# Altium schematic sheet Sheet1.SchDoc
size A3; SheetNumber: 1; SheetTotal: 1
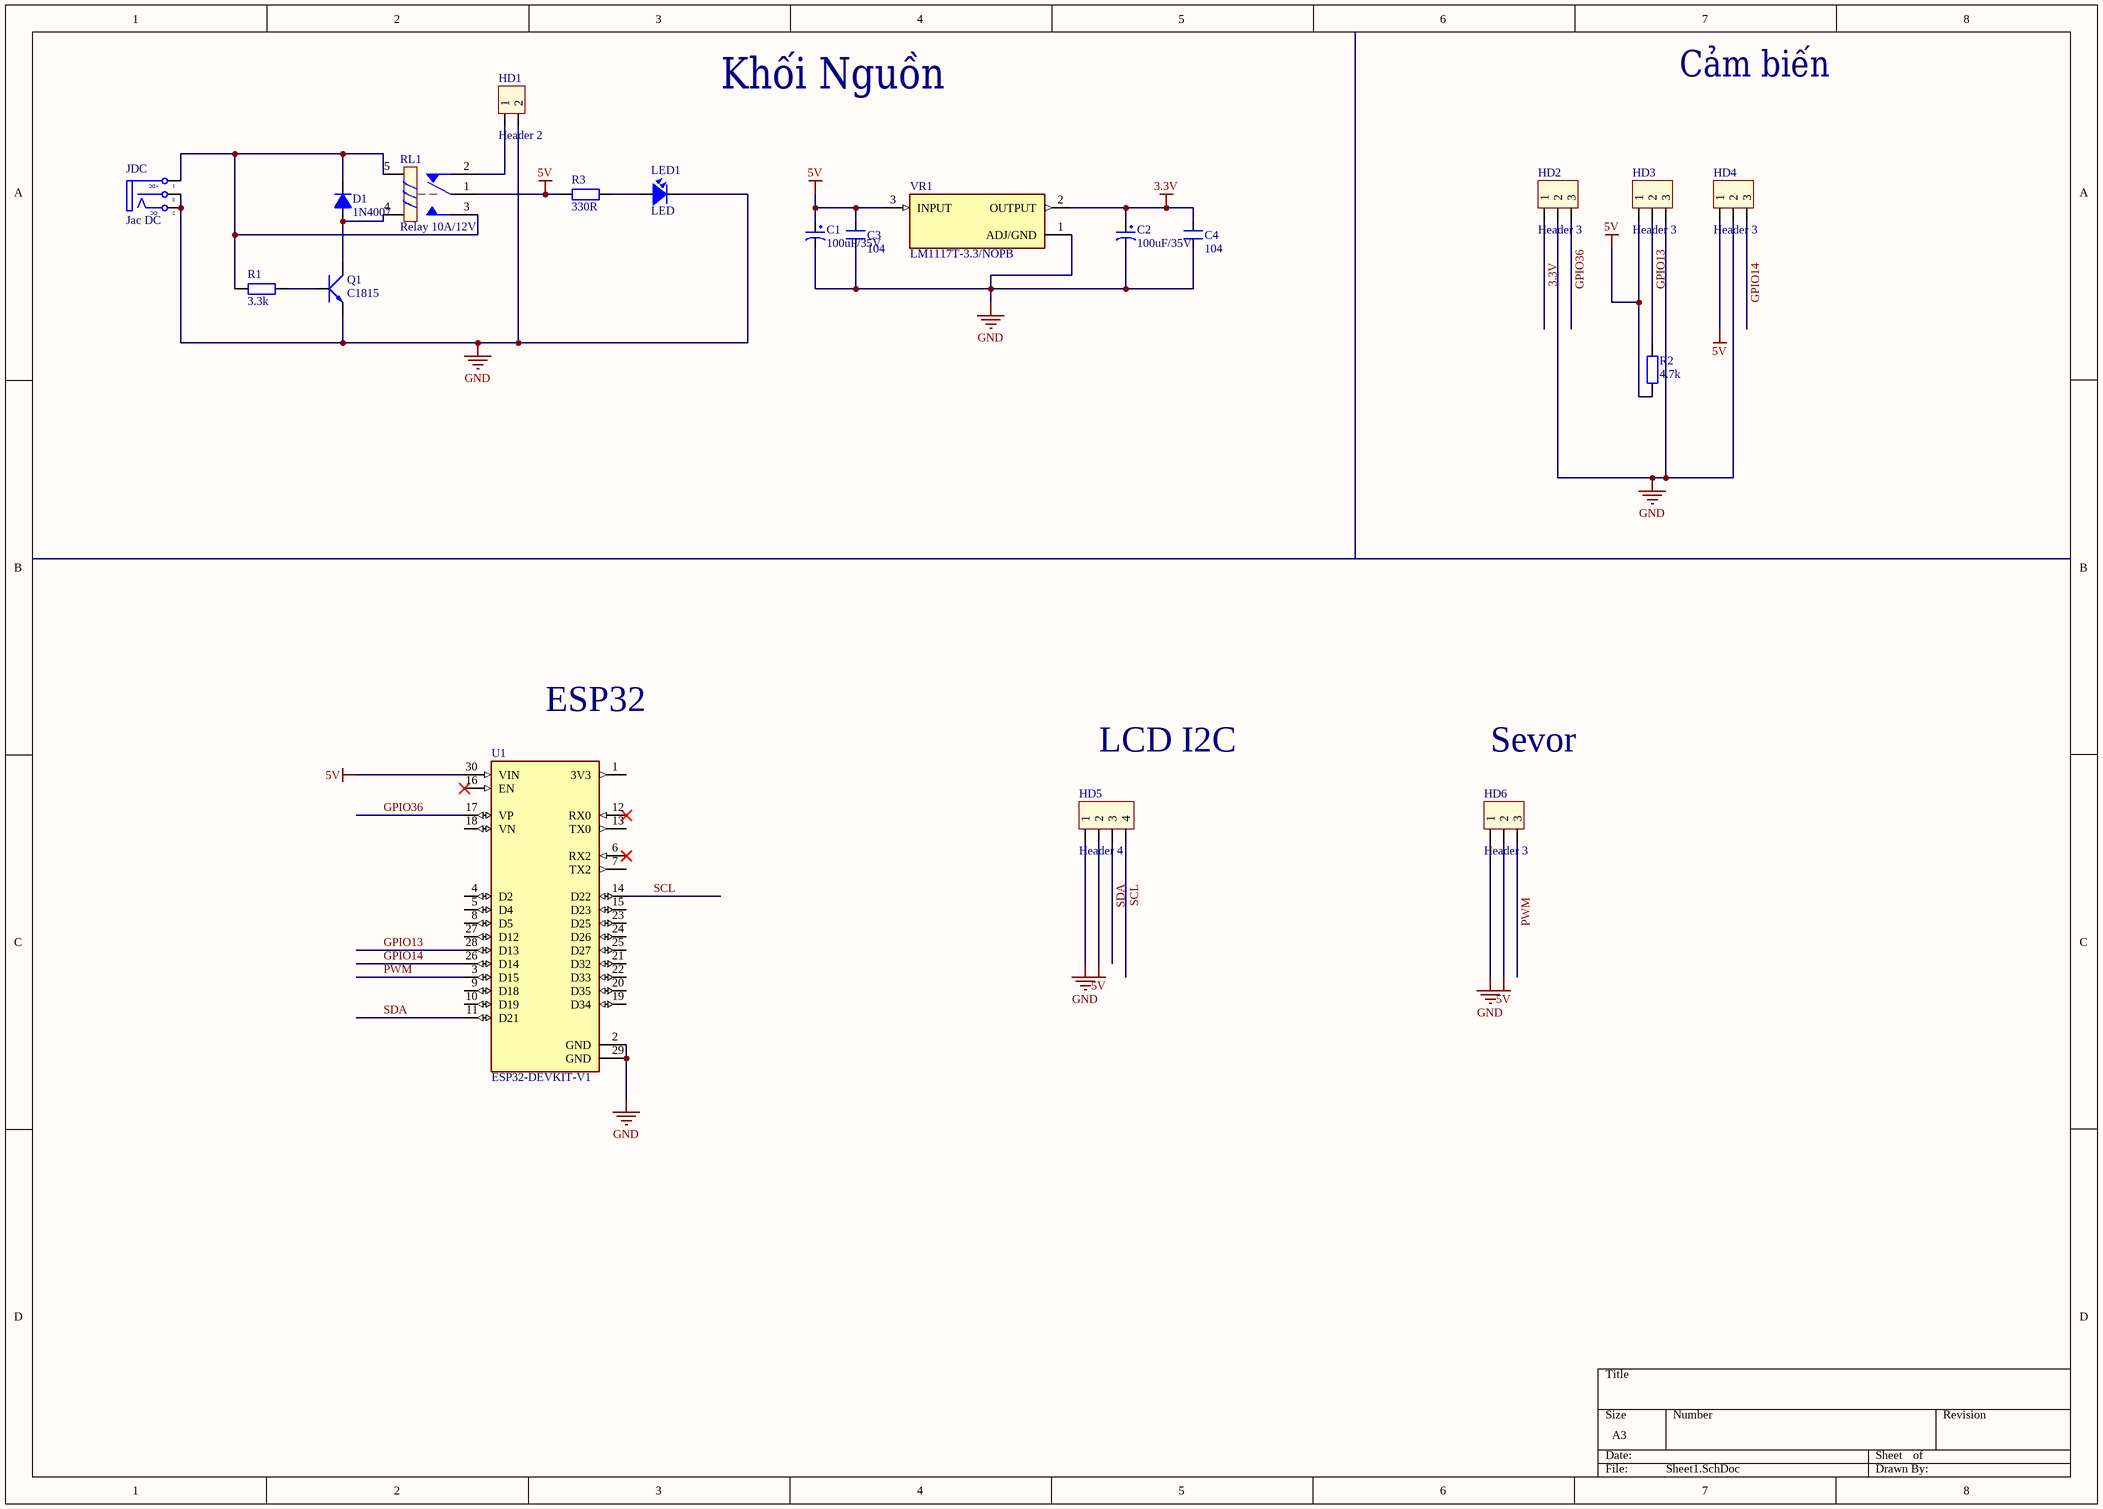
[diagram p0: Sheet1.SchDoc]

## Parts
C1  100uF/35V  [CP1.5/3.4]
C2  100uF/35V  [CP1.5/3.4]
C3  104  [CN2]
C4  104  [CN2]
D1  1N4007  [D1A]
HD1  Header 2  [HED2]
HD2  Header 3  [HED3]
HD3  Header 3  [HED3]
HD4  Header 3  [HED3]
HD5  Header 4  [HED4]
HD6  Header 3  [HED3]
JDC  Jac DC  [DC-IN]
LED1  LED  [LED-3]
Q1  C1815  [QTO-92]
R1  3.3k  [R1/4W]
R2  4.7k  [R1/4W]
R3  330R  [R1/4W]
RL1  Relay 10A/12V  [RL_SPDT_10A]
U1  ESP32-DEVKIT-V1  [MODULE_ESP32_DEVKIT_V1]
VR1  LM1117T-3.3/NOPB  [TO254P1054X470X1955-3]

## Nets
3.3V: C2.1 C4.2 HD2.1 VR1.2(OUTPUT)
5V: C1.1 C3.2 HD3.1 HD4.1 HD5.2 HD6.2 R2.2 R3.2 RL1.1 U1.30(VIN) VR1.3(INPUT)
GND: C1.2 C2.2 C3.1 C4.1 HD1.2 HD2.2 HD3.3 HD4.2 HD5.1 HD6.1 JDC.2(TN) JDC.3(S) LED1.2 Q1.1(E) U1.2(GND) U1.29(GND) VR1.1(ADJ/GND)
GPIO13: HD3.2 R2.1 U1.28(D13)
GPIO14: HD4.3 U1.26(D14)
GPIO36: HD2.3 U1.17(VP)
PWM: HD6.3 U1.3(D15)
SCL: HD5.4 U1.14(D22)
SDA: HD5.3 U1.11(D21)
NetD1_1: D1.1(A) Q1.2(C) RL1.4
NetD1_2: D1.2(K) JDC.1(T) R1.2 RL1.3 RL1.5
NetHD1_1: HD1.1 RL1.2
NetLED1_1: LED1.1 R3.1
NetQ1_3: Q1.3(B) R1.1

Not connected (* = marked no-connect by the designer): U1 1(3V3) 4(D2) 5(D4) 6(RX2)* 7(TX2) 8(D5) 9(D18) 10(D19) 12(RX0)* 13(TX0) 15(D23) 16(EN)* 18(VN) 19(D34) 20(D35) 21(D32) 22(D33) 23(D25) 24(D26) 25(D27) 27(D12)

## Notes on the sheet
- Khối Nguồn
- Cảm biến
- ESP32
- LCD I2C
- Sevor
- (in symbol DCIN) +DC; -DC

## Library data of the parts
C1 C2 = CP3: Cap 100uF/35V - 470uF/16V; Value: 100uF/35V/50V; Description 1: 1000uF/6,3V - 470uF/16V - 330uF - 25V; Description 2: 220uF/35V - 100uF/50V - 63V - 4,7uF/200V; Description 3: 22uF => 33uF100V - 3,3uF => 4,7uF/250V; Description 4: 2,2uF =>3,3uF/350 - 2,2uF/400V - 1uF/450V
C3 C4 = CN2: Cap np 104 => 105pF; Value: 0.1uF
D1 = D1A: Diode 1A; Value: 1N4007
HD1 = Hed2: Header 2 (Green); Value: Header 2
HD2-HD4 HD6 = Hed3: Header 3 (Green); Value: Header 3
HD5 = Hed4: Header 4 (Green); Value: Header 4
JDC = DCIN: Jac DC input; Value: Jac DC
LED1 = LED: LED Single colour Green and Red; Value: LED 3 ly Single Colour
Q1 = C1815: NPN 600mW, ECB; Value: C1815
R1-R3 = R1/4W: Resistor 1/4W; Value: R1/4W - 1K
RL1 = Relay 1: Relay SPDT,10A - 12VDC 5 Pin; Value: Relay SPDT, 10A, 12V
U1 = ESP32-DEVKIT-V1: Dual core, Wi-Fi: 2.4 GHz up to 150 Mbits/s,BLE (Bluetooth Low Energy) and legacy Bluetooth, 32 bits, Up to 240 MHz; MF: Do it; Price: None; Availability: Not in stock; Package: None; MP: ESP32-DEVKIT-V1; Value: *; SnapEDA_Link: https://www.snapeda.com/parts/ESP32-DEVKIT-V1/Do+it/view-part/?ref=snap; Check_prices: https://www.snapeda.com/parts/ESP32-DEVKIT-V1/Do+it/view-part/?ref=eda
VR1 = LM1117T-3.3/NOPB: 800-mA 15-V linear voltage regulator; MF: Texas Instruments; Package: TO-220-3 Texas Instruments; Price: None; Check_prices: https://www.snapeda.com/parts/LM1117T-3.3/NOPB/Texas+Instruments/view-part/?ref=eda; Value: *; SnapEDA_Link: https://www.snapeda.com/parts/LM1117T-3.3/NOPB/Texas+Instruments/view-part/?ref=snap; MP: LM1117T-3.3/NOPB; Availability: In Stock; Purchase-URL: https://pricing.snapeda.com/search/part/LM1117T-3.3/NOPB/?ref=eda